# EAGLE design ESC (EAGLE 9.6.2)

## Sheet 1 of 2: Connectors
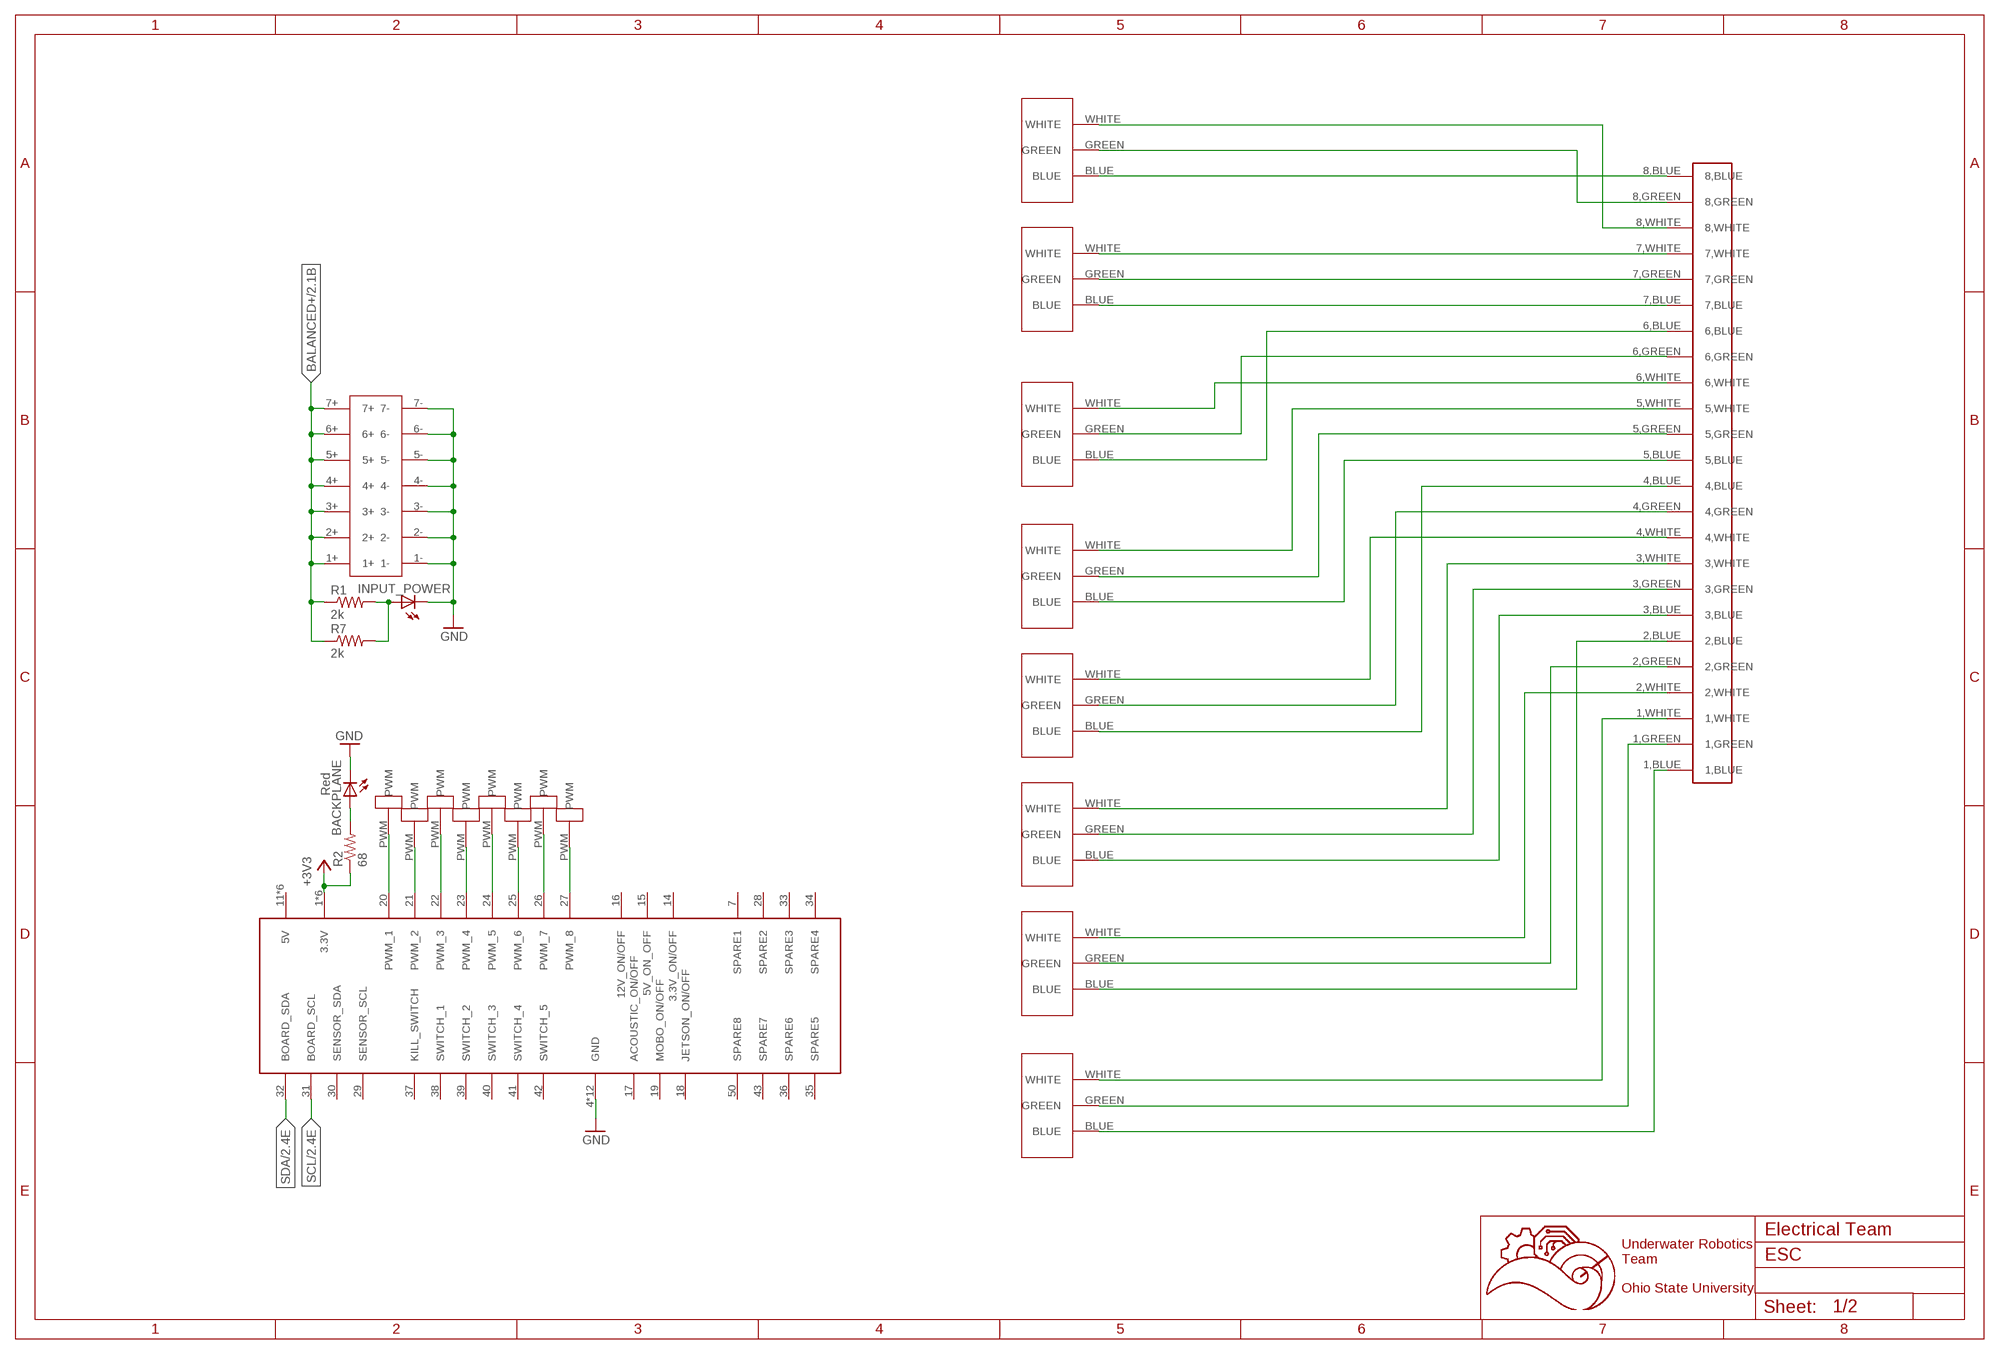
[diagram p0: schematic, sheet 1]

### Parts
1  1711738  [1711738]
2  1711738  [1711738]
3  1711738  [1711738]
4  1711738  [1711738]
5  1711738  [1711738]
6  1711738  [1711738]
7  1711738  [1711738]
8  1711738  [1711738]
BACKPLANE  Red  LEDCHIPLED_0603  [CHIPLED_0603]
INPUT_POWER  LEDCHIPLED_0603  [CHIPLED_0603]
P5  MALE1PINHEADER  [MALE1PINHEADER]
P6  MALE1PINHEADER  [MALE1PINHEADER]
P7  MALE1PINHEADER  [MALE1PINHEADER]
P8  MALE1PINHEADER  [MALE1PINHEADER]
R1  2k  R-US_R0603  [R0603]
R2  68  R-US_R0603  [R0603]
R7  2k  R-US_R0603  [R0603]
U$1  5530843-EDGE  [5530843-6-BOARDFINGERS]
U$18  24PINCONVERTER  [24PINCONVERTER]
U$19  14PIN_VERT  [14PIN_VERT]
U$20  MALE1PINHEADER  [MALE1PINHEADER]
U$21  MALE1PINHEADER  [MALE1PINHEADER]
U$22  MALE1PINHEADER  [MALE1PINHEADER]
U$23  MALE1PINHEADER  [MALE1PINHEADER]

### Nets
+3V3: R2.1 U$1.1(3.3V) U$1.2(3.3V) U$1.3(3.3V) U$1.54(3.3V) U$1.55(3.3V) U$1.56(3.3V) ; also sheet 2
BALANCED+: R1.1 R7.1 U$19.1+ U$19.2+ U$19.3+ U$19.4+ U$19.5+ U$19.6+ U$19.7+ ; also sheet 2
GND: BACKPLANE.C INPUT_POWER.C U$1.4(GND) U$1.5(GND) U$1.6(GND) U$1.8(GND) U$1.9(GND) U$1.10(GND) U$1.47(GND) U$1.48(GND) U$1.49(GND) U$1.51(GND) U$1.52(GND) U$1.53(GND) U$19.1- U$19.2- U$19.3- U$19.4- U$19.5- U$19.6- U$19.7- ; also sheet 2
N$1: 1.GREEN U$18.1,GREEN
N$2: 8.WHITE U$18.8,WHITE
N$3: 8.GREEN U$18.8,GREEN
N$4: 8.BLUE U$18.8,BLUE
N$5: 7.GREEN U$18.7,GREEN
N$6: 7.BLUE U$18.7,BLUE
N$7: 6.WHITE U$18.6,WHITE
N$8: 6.GREEN U$18.6,GREEN
N$9: 6.BLUE U$18.6,BLUE
N$10: 5.WHITE U$18.5,WHITE
N$11: 5.GREEN U$18.5,GREEN
N$12: 5.BLUE U$18.5,BLUE
N$13: 4.WHITE U$18.4,WHITE
N$14: 4.GREEN U$18.4,GREEN
N$15: 4.BLUE U$18.4,BLUE
N$16: 3.BLUE U$18.3,BLUE
N$17: 3.WHITE U$18.3,WHITE
N$18: 3.GREEN U$18.3,GREEN
N$19: 2.WHITE U$18.2,WHITE
N$20: 2.GREEN U$18.2,GREEN
N$21: 2.BLUE U$18.2,BLUE
N$22: 1.WHITE U$18.1,WHITE
N$23: 7.WHITE U$18.7,WHITE
N$24: 1.BLUE U$18.1,BLUE
N$25: INPUT_POWER.A R1.2 R7.2
N$26: BACKPLANE.A R2.2
PWM_1: U$1.20(PWM_1) U$20.PWM
PWM_2: U$1.21(PWM_2) U$21.PWM
PWM_3: U$1.22(PWM_3) U$22.PWM
PWM_4: U$1.23(PWM_4) U$23.PWM
PWM_5: P5.PWM U$1.24(PWM_5)
PWM_6: P6.PWM U$1.25(PWM_6)
PWM_7: P7.PWM U$1.26(PWM_7)
PWM_8: P8.PWM U$1.27(PWM_8)
SCL: U$1.31(BOARD_SCL) ; also sheet 2
SDA: U$1.32(BOARD_SDA) ; also sheet 2
Unconnected: U$1.7(SPARE1) U$1.11(5V) U$1.12(5V) U$1.13(5V) U$1.14(3.3V_ON/OFF) U$1.15(5V_ON_OFF) U$1.16(12V_ON/OFF) U$1.17(ACOUSTIC_ON/OFF) U$1.18(JETSON_ON/OFF) U$1.19(MOBO_ON/OFF) U$1.28(SPARE2) U$1.29(SENSOR_SCL) U$1.30(SENSOR_SDA) U$1.33(SPARE3) U$1.34(SPARE4) U$1.35(SPARE5) U$1.36(SPARE6) U$1.37(KILL_SWITCH) U$1.38(SWITCH_1) U$1.39(SWITCH_2) U$1.40(SWITCH_3) U$1.41(SWITCH_4) U$1.42(SWITCH_5) U$1.43(SPARE7) U$1.44(5V) U$1.45(5V) U$1.46(5V) U$1.50(SPARE8)

### Notes on the sheet
- Electrical Team
- Underwater Robotics
  Team
  
  Ohio State University

## Sheet 2 of 2
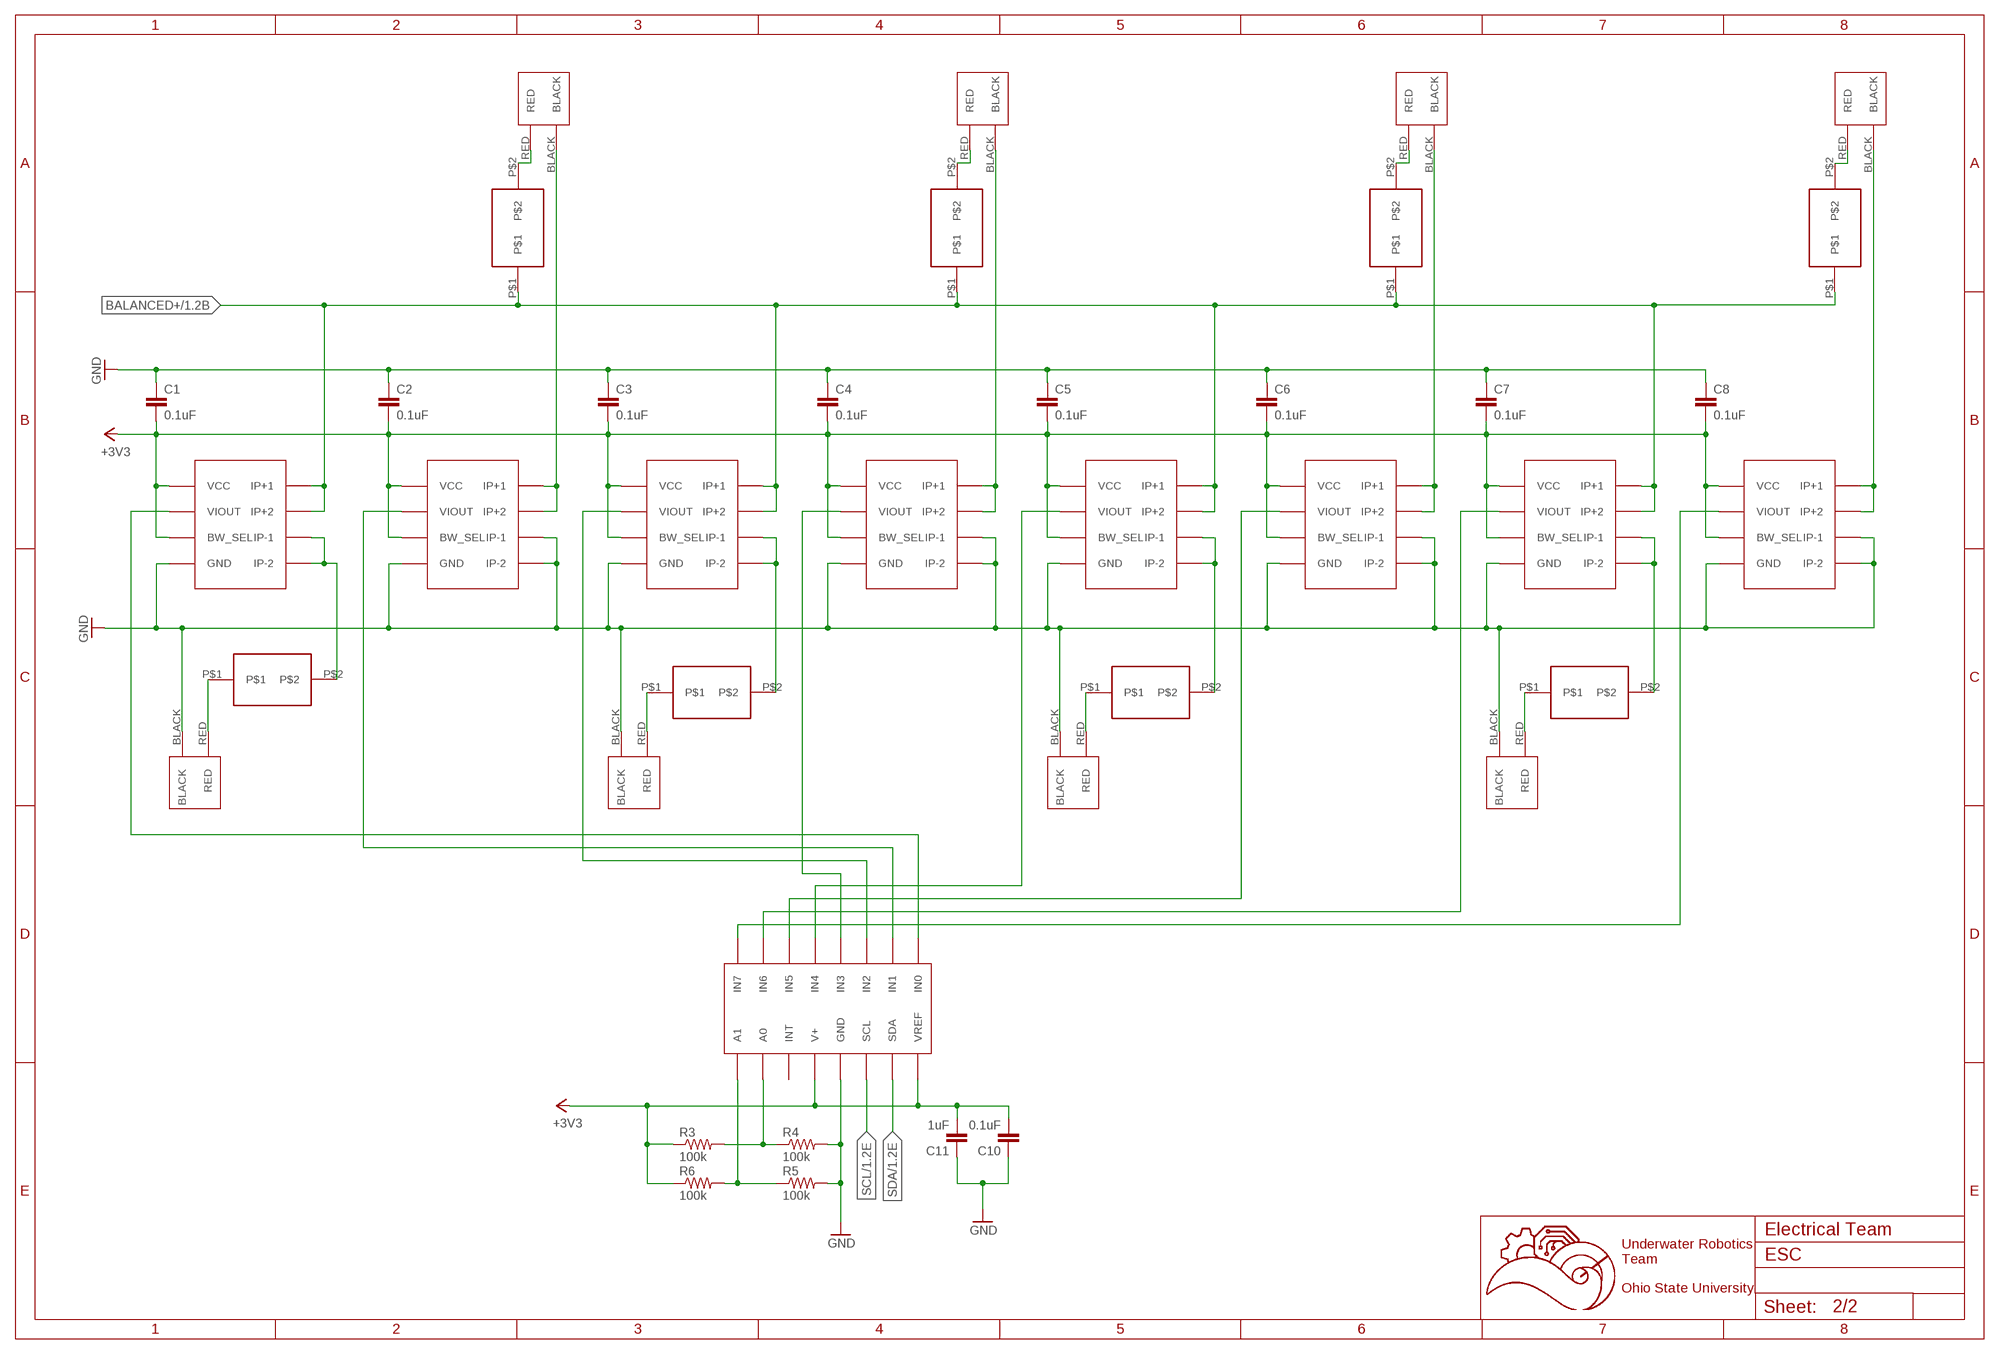
[diagram p1: schematic, sheet 2]

### Parts
1C  ACS722  [SOIC-8]
1CONNECT  1711725  [1711725]
2C  ACS722  [SOIC-8]
2CONNECT  1711725  [1711725]
3C  ACS722  [SOIC-8]
3CONNECT  1711725  [1711725]
4C  ACS722  [SOIC-8]
4CONNECT  1711725  [1711725]
5C  ACS722  [SOIC-8]
5CONNECT  1711725  [1711725]
6C  ACS722  [SOIC-8]
7C  ACS722  [SOIC-8]
7CONNECT  1711725  [1711725]
8C  ACS722  [SOIC-8]
8CONNECT  1711725  [1711725]
C1  0.1uF  C-EUC0603  [C0603]
C2  0.1uF  C-EUC0603  [C0603]
C3  0.1uF  C-EUC0603  [C0603]
C4  0.1uF  C-EUC0603  [C0603]
C5  0.1uF  C-EUC0603  [C0603]
C6  0.1uF  C-EUC0603  [C0603]
C7  0.1uF  C-EUC0603  [C0603]
C8  0.1uF  C-EUC0603  [C0603]
C10  0.1uF  C-EUC0603  [C0603]
C11  1uF  C-EUC0603  [C0603]
CONNECT  1711725  [1711725]
R3  100k  R-US_R0603  [R0603]
R4  100k  R-US_R0603  [R0603]
R5  100k  R-US_R0603  [R0603]
R6  100k  R-US_R0603  [R0603]
U$2  1206SFH  [1206SFH]
U$3  1206SFH  [1206SFH]
U$4  1206SFH  [1206SFH]
U$5  1206SFH  [1206SFH]
U$6  1206SFH  [1206SFH]
U$7  1206SFH  [1206SFH]
U$8  1206SFH  [1206SFH]
U$9  1206SFH  [1206SFH]
U$24  ADC128D818  [TSSOP-16]

### Nets
0ADC: 1C.VIOUT U$24.IN0
1ADC: 2C.VIOUT U$24.IN1
2ADC: 3C.VIOUT U$24.IN2
3ADC: 4C.VIOUT U$24.IN3
4ADC: 5C.VIOUT U$24.IN4
5ADC: 6C.VIOUT U$24.IN5
6ADC: 7C.VIOUT U$24.IN6
7ADC: 8C.VIOUT U$24.IN7
+3V3: 1C.BW_SEL 1C.VCC 2C.BW_SEL 2C.VCC 3C.BW_SEL 3C.VCC 4C.BW_SEL 4C.VCC 5C.BW_SEL 5C.VCC 6C.BW_SEL 6C.VCC 7C.BW_SEL 7C.VCC 8C.BW_SEL 8C.VCC C1.2 C2.2 C3.2 C4.2 C5.2 C6.2 C7.2 C8.2 C10.2 C11.2 R3.1 R6.1 U$24.V+ U$24.VREF ; also sheet 1
BALANCED+: 1C.IP+1 1C.IP+2 3C.IP+1 3C.IP+2 5C.IP+1 5C.IP+2 7C.IP+1 7C.IP+2 U$2.P$1 U$3.P$1 U$4.P$1 U$5.P$1 ; also sheet 1
GND: 1C.GND 1CONNECT.BLACK 2C.GND 2C.IP-1 2C.IP-2 3C.GND 3CONNECT.BLACK 4C.GND 4C.IP-1 4C.IP-2 5C.GND 5CONNECT.BLACK 6C.GND 6C.IP-1 6C.IP-2 7C.GND 7CONNECT.BLACK 8C.GND 8C.IP-1 8C.IP-2 C1.1 C2.1 C3.1 C4.1 C5.1 C6.1 C7.1 C8.1 C10.1 C11.1 R4.2 R5.2 U$24.GND ; also sheet 1
N$27: 8C.IP+1 8C.IP+2 8CONNECT.BLACK
N$28: 2CONNECT.RED U$2.P$2
N$29: 4CONNECT.RED U$4.P$2
N$30: 1C.IP-1 1C.IP-2 U$6.P$2
N$31: CONNECT.RED U$5.P$2
N$32: 2C.IP+1 2C.IP+2 2CONNECT.BLACK
N$33: 3C.IP-1 3C.IP-2 U$7.P$2
N$34: 5C.IP-1 5C.IP-2 U$8.P$2
N$35: 4C.IP+1 4C.IP+2 4CONNECT.BLACK
N$36: 6C.IP+1 6C.IP+2 CONNECT.BLACK
N$37: 7C.IP-1 7C.IP-2 U$9.P$2
N$38: 8CONNECT.RED U$3.P$2
N$39: 1CONNECT.RED U$6.P$1
N$40: 3CONNECT.RED U$7.P$1
N$41: 5CONNECT.RED U$8.P$1
N$42: 7CONNECT.RED U$9.P$1
N$44: R3.2 R4.1 U$24.A0
N$46: R5.1 R6.2 U$24.A1
SCL: U$24.SCL ; also sheet 1
SDA: U$24.SDA ; also sheet 1
Unconnected: U$24.INT

### Notes on the sheet
- Electrical Team
- Underwater Robotics
  Team
  
  Ohio State University

## Library data of the parts
1-8 = Screw_Terminals:1711738
1C 2C 3C 4C 5C 6C 7C 8C = ACS722:ACS722
1CONNECT 2CONNECT 3CONNECT 4CONNECT 5CONNECT 7CONNECT 8CONNECT CONNECT = Screw_Terminals:1711725: 2-pin screw terminal
BACKPLANE INPUT_POWER = led:LED: LED OSRAM: - CHIPLED LG R971, LG N971, LY N971, LG Q971, LY Q971, LO R971, LY R971 LH N974, LH R974 LS Q976, LO Q976, LY Q976 LO Q996 - Hyper CHIPLED LW Q18S LB Q993, LB Q99A, LB R99A - SideLED LS A670, LO A670, LY A670, LG A670, LP A670 LB A673, LV A673, LT A673, LW A673 LH A674 LY A675 LS A676, LA A676, LO A676, LY A676, LW A676 LS A679, LY A679, LG A679 - Hyper Micro SIDELED® LS Y876, LA Y876, LO Y876, LY Y876 LT Y87S - SmartLED LW L88C, LW L88S LB L89C, LB L89S, LG L890 LS L89K, LO L89K, LY L89K LS L896, LA L896, LO L896, LY L896 - TOPLED LS T670, LO T670, LY T670, LG T670, LP T670 LSG T670, LSP T670, LSY T670, LOP T670, LYG T670 LG T671, LOG T671, LSG T671 LB T673, LV T673, LT T673, LW T673 LH T674 LS T676, LA T676, LO T676, LY T676, LB T676, LH T676, LSB T676, LW T676 LB T67C, LV T67C, LT T67C, LS T67K, LO T67K, LY T67K, LW E67C LS E67B, LA E67B, LO E67B, LY E67B, LB E67C, LV E67C, LT E67C LW T67C LS T679, LY T679, LG T679 LS T770, LO T770, LY T770, LG T770, LP T770 LB T773, LV T773, LT T773, LW T773 LH T774 LS E675, LA E675, LY E675, LS T675 LS T776, LA T776, LO T776, LY T776, LB T776 LHGB T686 LT T68C, LB T68C - Hyper Mini TOPLED® LB M676 - Mini TOPLED Santana® LG M470 LS M47K, LO M47K, LY M47K Source: http://www.osram.convergy.de LUXEON: - LUMILED® LXK2-PW12-R00, LXK2-PW12-S00, LXK2-PW14-U00, LXK2-PW14-V00 LXK2-PM12-R00, LXK2-PM12-S00, LXK2-PM14-U00 LXK2-PE12-Q00, LXK2-PE12-R00, LXK2-PE12-S00, LXK2-PE14-T00, LXK2-PE14-U00 LXK2-PB12-K00, LXK2-PB12-L00, LXK2-PB12-M00, LXK2-PB14-N00, LXK2-PB14-P00, LXK2-PB14-Q00 LXK2-PR12-L00, LXK2-PR12-M00, LXK2-PR14-Q00, LXK2-PR14-R00 LXK2-PD12-Q00, LXK2-PD12-R00, LXK2-PD12-S00 LXK2-PH12-R00, LXK2-PH12-S00 LXK2-PL12-P00, LXK2-PL12-Q00, LXK2-PL12-R00 Source: www.luxeon.com KINGBRIGHT: KA-3528ASYC Source: www.kingbright.com
C1-C8 C10 C11 = rcl:C-EU: CAPACITOR, European symbol; SPICEPREFIX: C
P5-P8 U$20-U$23 = Male_Header_1Pin:MALE1PINHEADER
R1-R7 = resistor:R-US_: RESISTOR, American symbol
U$1 = 5530843-6:5530843-EDGE
U$2-U$9 = 1206SFH:1206SFH
U$18 = 24_Pin_Connector:24PINCONVERTER
U$19 = 14_Pin_Connector_Vert:14PIN_VERT
U$24 = ADC128D818:ADC128D818

## Board
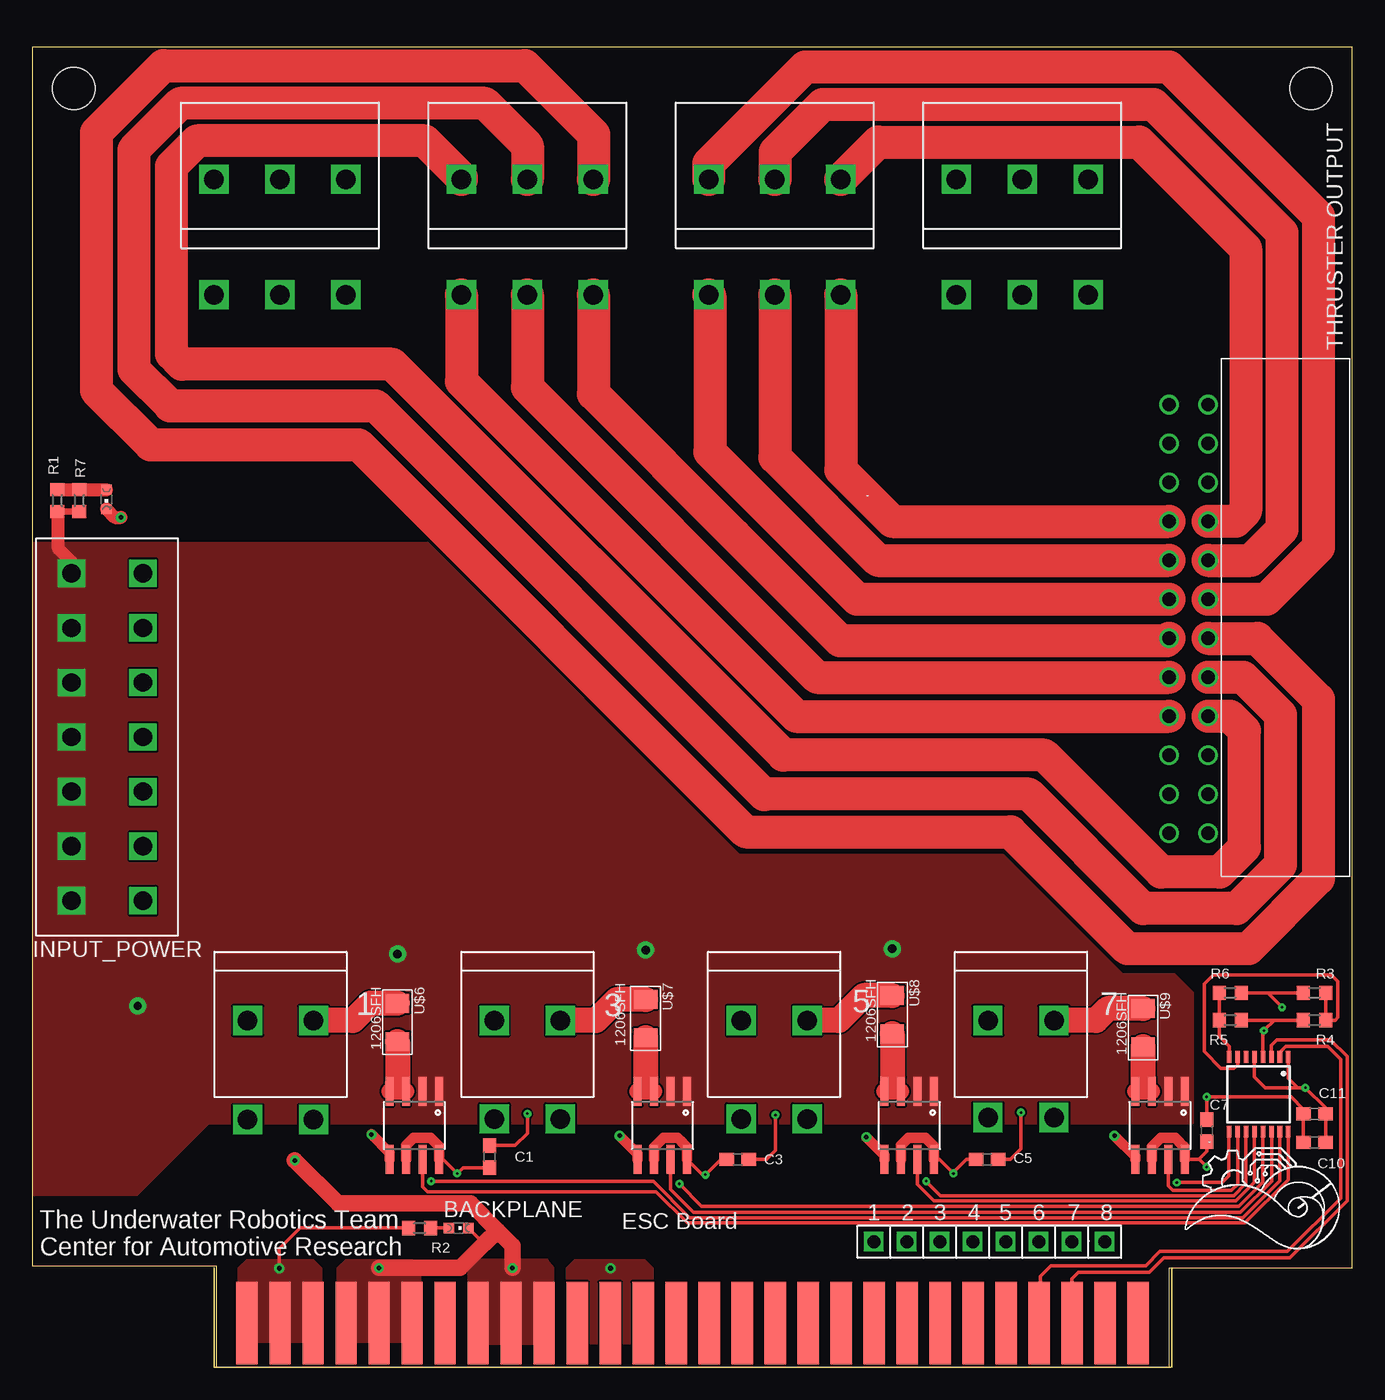
[diagram p2: board, top side]
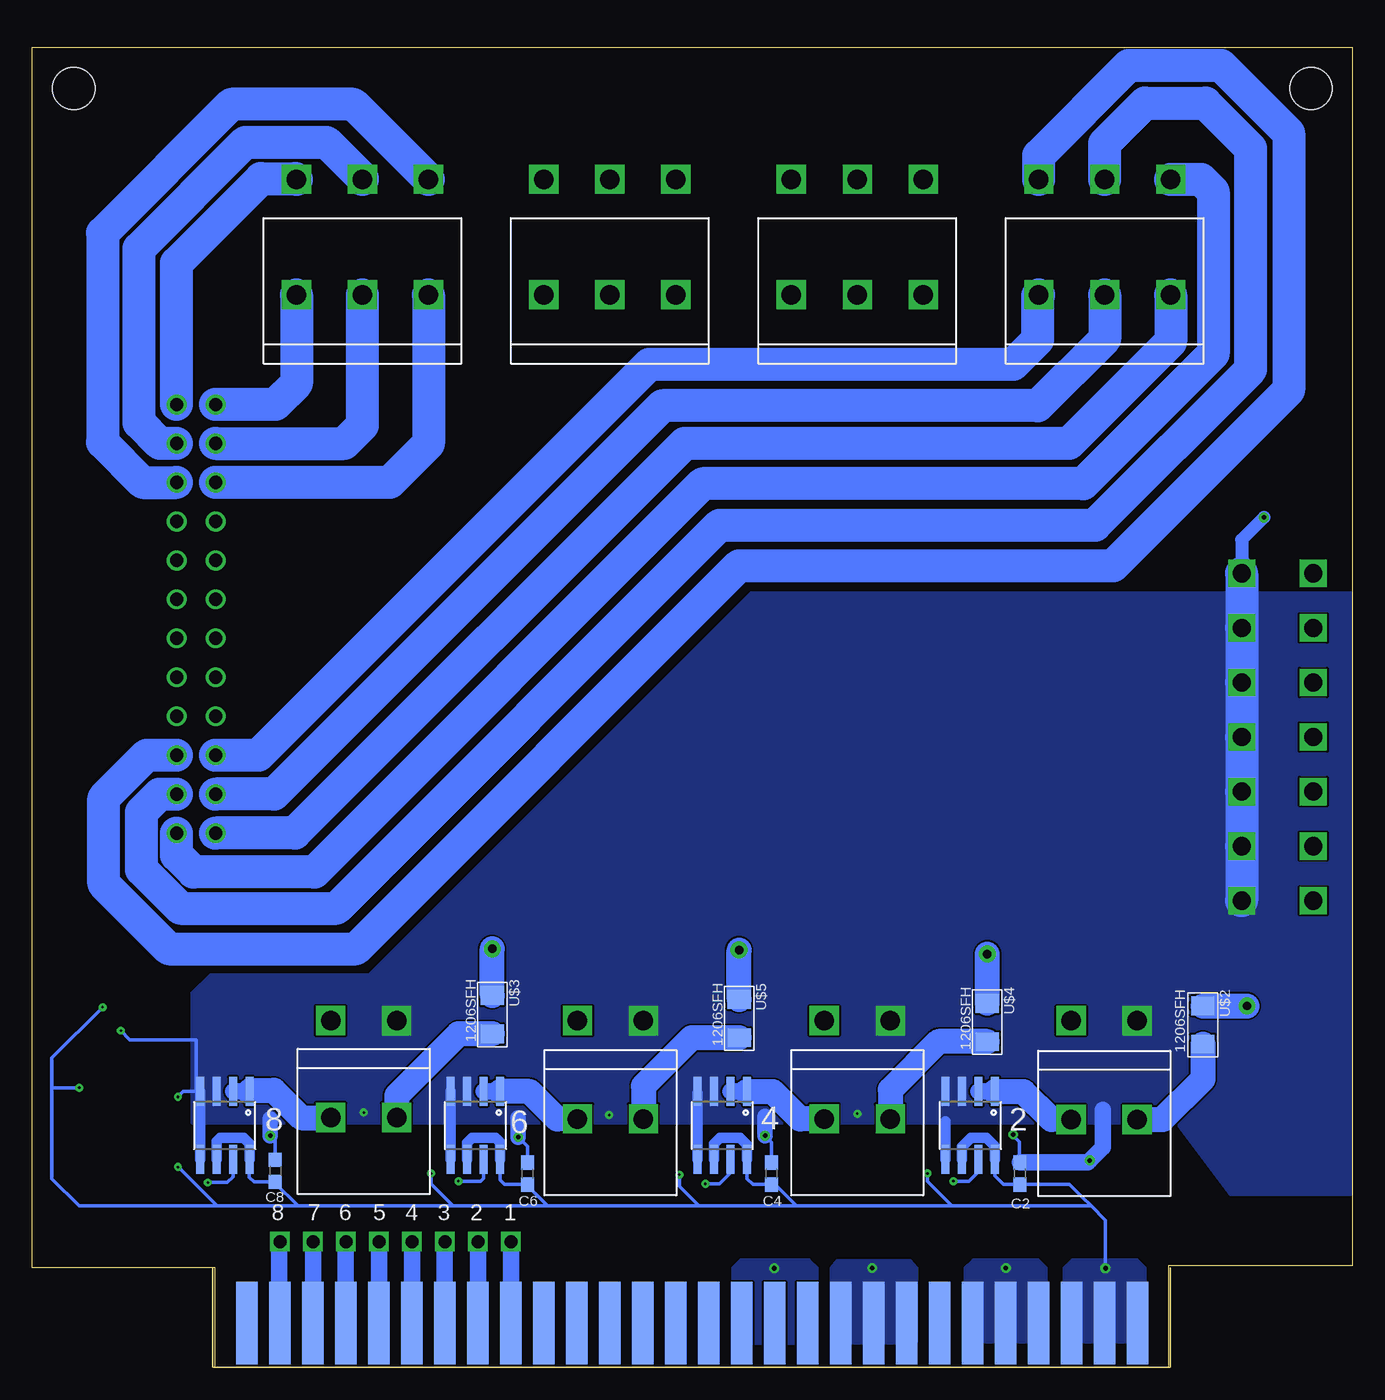
[diagram p3: board, bottom side, seen from below]

Size 101.6 x 101.6 mm. Coordinates in mm from the lower left corner, seen from the top.
Outline: 14.14,7.8 14.14,0 87.53,0 87.53,7.62 101.6,7.62 101.6,101.6 0,101.6 0,7.8 14.14,7.8
Copper layers (1*16): Top 0.035mm / dielectric 1.5mm / Bottom 0.035mm
Design rules "default *": minimum track width 6mil, minimum drill 0.2mm, track to track 6mil, track to pad 6mil, pad to pad 6mil, via to via 6mil, smd to smd 6mil, copper to edge 0.00508125mm, drill to drill 6mil, minimum pad ring 10mil, minimum via ring 8mil, stop-mask expansion 4mil, vias tented up to drill 0mil, thermal gap 10mil
Holes 3.26 mm at 3.17,98.42 98.42,98.42

### Footprints (pad centres in the part's own frame; a part is rotated, then mirrored left to right if it is on the bottom)
1711738 = drill 1.5 square: BLUE -5.08,0; GREEN 0,0; WHITE 5.08,0
SOIC-8 = smd 0.61 x 2.21: BW_SEL 0.635,2.616; GND 1.905,2.616; IP+1 -1.905,-2.616; IP+2 -0.635,-2.616; IP-1 0.635,-2.616; IP-2 1.905,-2.616; VCC -1.905,2.616; VIOUT -0.635,2.616
1711725 = drill 1.5 square: BLACK -2.54,0; RED 2.54,0
CHIPLED_0603 = smd 0.8 x 0.8: A 0,-0.75; C 0,0.75
C0603 = smd 1.1 x 1: 1 -0.85,0; 2 0.85,0
MALE1PINHEADER = drill 1 square: PWM 0,0
R0603 = smd 1 x 1.1: 1 -0.85,0; 2 0.85,0
5530843-6-BOARDFINGERS = smd 1.651 x 6.35 bottom: 1 0.826,3.375; 2 3.365,3.375; 3 5.905,3.375; 4 8.445,3.375; 5 10.986,3.375; 6 13.525,3.375; 7 16.066,3.375; 8 18.605,3.375; 9 21.145,3.375; 10 23.686,3.375; 11 26.226,3.375; 12 28.765,3.375; 13 31.305,3.375; 14 33.846,3.375; 15 36.386,3.375; 16 38.925,3.375; 17 41.465,3.375; 18 44.005,3.375; 19 46.545,3.375; 20 49.086,3.375; 21 51.626,3.375; 22 54.166,3.375; 23 56.706,3.375; 24 59.245,3.375; 25 61.785,3.375; 26 64.326,3.375; 27 66.865,3.375; 28 69.406,3.375 | smd 1.651 x 6.35: 29 69.406,3.375; 30 66.865,3.375; 31 64.326,3.375; 32 61.785,3.375; 33 59.245,3.375; 34 56.706,3.375; 35 54.166,3.375; 36 51.626,3.375; 37 49.086,3.375; 38 46.545,3.375; 39 44.005,3.375; 40 41.465,3.375; 41 38.925,3.375; 42 36.386,3.375; 43 33.846,3.375; 44 31.305,3.375; 45 28.765,3.375; 46 26.226,3.375; 47 23.686,3.375; 48 21.145,3.375; 49 18.605,3.375; 50 16.066,3.375; 51 13.525,3.375; 52 10.986,3.375; 53 8.445,3.375; 54 5.905,3.375; 55 3.365,3.375; 56 0.826,3.375
1206SFH = smd 1.448 x 1.803: P$1 0,0; P$2 2.946,0
24PINCONVERTER = drill 1.02: 1,BLUE 3,0; 1,GREEN 3,3; 1,WHITE 3,6; 2,BLUE 0,6; 2,GREEN 0,3; 2,WHITE 0,0; 3,BLUE 3,9; 3,GREEN 3,12; 3,WHITE 3,15; 4,BLUE 0,15; 4,GREEN 0,12; 4,WHITE 0,9; 5,BLUE 3,18; 5,GREEN 3,21; 5,WHITE 3,24; 6,BLUE 0,24; 6,GREEN 0,21; 6,WHITE 0,18; 7,BLUE 3,27; 7,GREEN 3,30; 7,WHITE 3,33; 8,BLUE 0,33; 8,GREEN 0,30; 8,WHITE 0,27
14PIN_VERT = drill 1.4 square: 1+ 0,0; 1- 5.5,0; 2+ 0,4.2; 2- 5.5,4.2; 3+ 0,8.4; 3- 5.5,8.4; 4+ 0,12.6; 4- 5.5,12.6; 5+ 0,16.8; 5- 5.5,16.8; 6+ 0,21; 6- 5.5,21; 7+ 0,25.2; 7- 5.5,25.2
TSSOP-16 = smd 0.9 x 0.35: A0 -2.875,-1.625; A1 -2.875,-2.275; GND -2.875,0.325; IN0 2.875,2.275; IN1 2.875,1.625; IN2 2.875,0.975; IN3 2.875,0.325; IN4 2.875,-0.325; IN5 2.875,-0.975; IN6 2.875,-1.625; IN7 2.875,-2.275; INT -2.875,-0.975; SCL -2.875,0.975; SDA -2.875,1.625; V+ -2.875,-0.325; VREF -2.875,2.275

### Placement (x,y rotation side)
1  19.05,91.44 0 top
1C  29.4,18.6 180 top
1CONNECT  19.1,26.67 0 top
2  19.05,82.55 0 bottom
2C  29.4,18.6 180 bottom
2CONNECT  19.1,19.05 0 bottom
3  38.1,91.44 0 top
3C  48.5,18.6 180 top
3CONNECT  38.1,26.67 0 top
4  38.1,82.55 0 bottom
4C  48.5,18.6 180 bottom
4CONNECT  38.1,19.1 0 bottom
5  57.15,91.44 0 top
5C  67.5,18.6 180 top
5CONNECT  57.1,26.67 0 top
6  57.15,82.55 0 bottom
6C  67.5,18.6 180 bottom
7  76.2,91.44 0 top
7C  86.8,18.6 180 top
7CONNECT  76.1,26.67 0 top
8  76.2,82.55 0 bottom
8C  86.8,18.6 180 bottom
8CONNECT  76.1,19.2 0 bottom
BACKPLANE  32.8,10.7 270 top
C1  35.2,16.2 270 top
C2  25.6,14.9 270 bottom
C3  54.3,16 180 top
C4  44.7,14.9 270 bottom
C5  73.5,16 180 top
C6  63.5,14.9 270 bottom
C7  90.4,18.2 270 top
C8  82.9,15.1 270 bottom
C10  98.7,17.3 0 top
C11  98.7,19.5 0 top
CONNECT  57.1,19.1 0 bottom
INPUT_POWER  5.7,66.8 180 top
P5  74.93,9.65 0 top
P6  77.47,9.65 0 top
P7  80.01,9.65 0 top
P8  82.55,9.65 90 top
R1  1.9,66.7 90 top
R2  29.8,10.7 0 top
R3  98.7,28.8 0 top
R4  98.7,26.7 180 top
R5  92.2,26.7 0 top
R6  92.2,28.8 180 top
R7  3.6,66.7 90 top
U$1  15.7,0 0 top
U$2  11.5,27.8 270 bottom
U$3  66.2,28.6 270 bottom
U$4  28.1,28 270 bottom
U$5  47.2,28.3 270 bottom
U$6  28.1,28 270 top
U$7  47.2,28.3 270 top
U$8  66.2,28.6 270 top
U$9  85.5,27.6 270 top
U$18  87.5,41.1 0 top
U$19  3,35.9 0 top
U$20  64.77,9.65 270 top
U$21  67.31,9.65 0 top
U$22  69.85,9.65 0 top
U$23  72.39,9.65 0 top
U$24  94.4,21 270 top

### Tracks (layer width: path | path; a pad name or v marks a point on that pad's centre or on a via)
0ADC
  Top 0.254: 1C.VIOUT 30.04,13.87 30.4,13.5 48,13.5 50.41,11.09 93.34,11.09 96.68,14.43 U$24.IN0
1ADC  (via drill 0.2 pad 0.55)
  Top 0.254: v30.7,14.3 47.8,14.3 50.6,11.5 50.61,11.49 93.17,11.49 96.03,14.35 U$24.IN1
  Bottom 0.254: 2C.VIOUT 28.77,15.04 29.5,14.3 v30.7,14.3
2ADC
  Top 0.254: 3C.VIOUT 49.13,13.66 50.9,11.9 93,11.9 95.4,14.3 95.4,18.1 U$24.IN2
3ADC  (via drill 0.2 pad 0.55)
  Top 0.254: v49.8,14.1 51.52,12.38 92.88,12.38 94.72,14.22 U$24.IN3
  Bottom 0.254: 4C.VIOUT 47.87,14.94 48.7,14.1 v49.8,14.1
4ADC
  Top 0.254: U$24.IN4 94.08,14.23 92.64,12.79 69.4,12.79 68.14,14.05 5C.VIOUT
5ADC  (via drill 0.2 pad 0.55)
  Top 0.254: v68.8,14.3 69.91,13.19 92.47,13.19 93.42,14.15 U$24.IN5
  Bottom 0.254: 6C.VIOUT 66.86,14.54 67.1,14.3 v68.8,14.3
6ADC
  Top 0.254: 7C.VIOUT 87.44,13.96 87.8,13.6 92.3,13.6 92.78,14.07 U$24.IN6
7ADC  (via drill 0.2 pad 0.55)
  Top 0.254: v88.1,14.2 91.6,14.2 92.1,14.7 92.1,18.1 U$24.IN7
  Bottom 0.254: 8C.VIOUT 86.17,14.63 86.6,14.2 v88.1,14.2
+3V3  (via drill 0.2, 0.2 pad 0.55, 0.35)
  Top 0.254: R2.1 20.6,10.7 19,9.1 v19,7.6 | C3.2 53,16 v51.8,14.8 51.59,14.8 3C.VCC | C5.2 71.9,16 70.9,15 v70.9,14.9 69.82,15.98 5C.VCC | 89.78,15.98 90.4,16.6 C7.2 | v90.4,15.4 89.82,15.98 89.78,15.98 | U$24.V+ 94.08,22.32 94.9,21.5 v98,21.5 | v98,21.5 97.4,21.5 96.67,22.23 U$24.VREF | C10.2 C11.2 99.55,19.95 v98,21.5 | 89.78,15.98 7C.VCC | 1C.VCC 31.62,15.98 v32.7,14.9 33.15,15.35 C1.2 | R6.1 95.1,28.8 | 95.1,28.8 R3.1 | v96.2,27.7 95.1,28.8
  Top 0.813: 1C.BW_SEL 28.77,17.07 29.35,17.65 30.65,17.65 31.3,17 1C.VCC | 3C.BW_SEL 47.87,16.91 48.6,17.65 49.67,17.65 50,17.32 50,17.3 50.41,16.89 3C.VCC | 5C.BW_SEL 66.86,17.07 67.45,17.65 68.75,17.65 69.41,17 5C.VCC | 7C.BW_SEL 86.17,16.96 86.85,17.65 87.97,17.65 88.3,17.32 88.3,17.3 88.7,16.89 7C.VCC
  Bottom 0.254: v19,7.6 19,11.3 20.1,12.4 | 20.1,12.4 30.8,12.4 | 30.8,12.4 42.8,12.4 | 42.8,12.4 50.3,12.4 | 50.3,12.4 61.95,12.4 | 61.95,12.4 69.2,12.4 | 69.2,12.4 81.2,12.4 | 81.2,12.4 87.4,12.4 | 87.4,12.4 98,12.4 100.1,14.5 100.1,21.5 | 20.1,12.4 20.8,13.1 21.77,14.05 C2.2 26.85,14.05 27.5,14.7 2C.VCC | 42.8,12.4 44.45,14.05 C4.2 46.15,14.05 46.59,14.49 4C.VCC | v32.7,14.9 32.7,14.3 30.8,12.4 | v51.8,14.8 51.8,13.9 50.3,12.4 | 61.95,12.4 63.5,13.95 C6.2 65.25,14.05 65.6,14.4 6C.VCC | v70.9,14.9 70.9,14.1 69.2,12.4 | 81.2,12.4 81.2,12.45 82.9,14.15 C8.2 84.55,14.25 84.9,14.6 8C.VCC | v90.4,15.4 87.4,12.4 | v98,21.5 100.1,21.5 | 100.1,21.5 100.1,23.8 v96.2,27.7
  Bottom 0.813: 2C.BW_SEL 30.04,16.96 29.35,17.65 28.15,17.65 27.5,17 2C.VCC | 4C.VCC 46.59,17.09 47.15,17.65 48.65,17.65 49.13,17.16 4C.BW_SEL | 6C.VCC 65.59,17.3 65.95,17.65 67.75,17.65 68.14,17.27 6C.BW_SEL | 8C.VCC 84.89,17.2 85.35,17.65 87.15,17.65 87.44,17.36 8C.BW_SEL
  pour Bottom (no thermals): 15.88,7.62 16.51,8.26 21.59,8.26 22.23,7.62 22.23,1.91 15.88,1.91
  pour Top (no thermals): 15.88,7.62 16.51,8.26 21.59,8.26 22.23,7.62 22.23,1.91 15.88,1.91
+5V  (via drill 0.35)
  other vias: 44.5,7.6
  pour Top (no thermals): 41.15,1.78 41.15,7.62 41.78,8.26 47.12,8.26 47.75,7.62 47.75,1.78
  pour Bottom (no thermals): 41.15,1.78 41.15,7.62 41.78,8.26 47.12,8.26 47.75,7.62 47.75,1.78
BALANCED+  (via drill 0.65 pad 1.3)
  Top 0.508: R1.1 R7.1
  Top 1.016: U$19.7+ 3,62 2,63 2,65.75 R1.1
  Bottom 1.905: U$2.P$1 v8.1,27.8 | U$4.P$1 v28.1,31.8 | U$5.P$1 v47.2,32.1 | U$3.P$1 v66.2,32.2
  pour Top (no thermals): 0.11,63.4 0.11,13.3 8.01,13.3 13.51,18.8 89.3,18.8 89.3,28.8 87.9,30.2 83.9,30.2 74.7,39.4 54.4,39.4 30.4,63.4
GND  (via drill 0.2, 0.2 pad 0.55, 0.35, 0.35 pad 0.55)
  Top 0.254: C3.1 56.5,16 57.2,16.7 v57.2,19.4 | C5.1 75.3,16 76.1,16.8 v76.1,19.6 | C7.1 v90.4,20.8 96.9,20.8 97.85,19.85 C11.1 C10.1 | R5.2 95.6,26.7 | 95.6,26.7 R4.2 | 95.6,26.7 v94.8,25.9 94.72,25.82 U$24.GND | BACKPLANE.C 34.77,9.47 | C1.1 37.15,17.05 38.1,18 v38.1,19.5
  Top 0.813: 1C.GND 27.5,16.5 v26.1,17.9 | 3C.GND 46.59,16.41 v45.2,17.8 | 5C.GND 65.59,16.3 v64.2,17.7 | 7C.GND 84.89,16.2 v83.3,17.8
  Top 1.016: INPUT_POWER.C 6.35,65.4 v6.8,65.4
  Top 1.27: v20.2,15.9 23.51,12.59 33.71,12.59 35.8,10.5 | v36.96,7.62 36.96,9.34 35.8,10.5 | v26.67,7.62 32.92,7.62 34.77,9.47 35.8,10.5
  Bottom 0.152: 20.35,15.75 v20.2,15.9 | 31.3,18.91 31.4,19
  Bottom 0.254: C4.1 44.7,17.3 v45.2,17.8 | C6.1 63.5,17 v64.2,17.7 | C8.1 82.9,17.4 v83.3,17.8 | v90.4,20.8 89.98,21.22 88.9,21.22 | 88.9,21.22 8C.IP-2 | 88.9,21.22 89,21.32 89,25.2 94.1,25.2 v94.8,25.9 | v26.1,17.9 26.1,17.8 25.62,17.32 25.62,15.78 C2.1
  Bottom 0.813: 4C.GND 50.41,21.09 50.4,21.1 | 6C.GND 6C.IP-2 | 8C.GND 8C.IP-2 | 2C.GND 31.3,18.91
  Bottom 1.016: v6.8,65.4 8.5,63.7 U$19.7-
  Bottom 1.2: v45.2,17.8 45.2,19.3 | v64.2,17.7 64.2,19.2 | v83.3,17.8 83.3,19.1
  Bottom 1.27: C2.1 20.35,15.75 | v20.2,15.9 19.2,16.9 19.2,19.8
  Bottom 2.54: U$19.7- U$19.6- U$19.5- U$19.4- U$19.3- U$19.2- U$19.1-
  pour Top (no thermals): 23.5,7.62 24.13,8.26 29.21,8.26 29.84,7.62 29.84,1.91 23.5,1.91
  pour Bottom (no thermals): 23.5,7.62 24.13,8.26 29.21,8.26 29.84,7.62 29.84,1.91 23.5,1.91
  pour Top (no thermals): 33.66,1.78 40.13,1.78 40.13,7.62 39.62,8.26 34.04,8.26 33.53,7.62 33.53,1.91
  pour Bottom (no thermals): 33.53,7.62 33.53,1.91 33.66,1.78 40.01,1.78 40.01,4.06 40.01,5.71 40.13,5.84 40.13,7.62 39.62,8.26 34.04,8.26
  pour Bottom (no thermals): 0.11,59.6 46.3,59.6 75.7,30.2 87.9,30.2 89.3,28.8 89.3,18.8 13.51,18.8 9.4,13.3 0.11,13.3
N$1
  Bottom 2.54: 1.GREEN 19.05,94.2 15.95,97.3 11.3,97.3 7.81,93.81 7.81,76.79 19.8,64.8 48.7,64.8 78.19,35.31 90.21,35.31 93.19,38.29 93.19,42.72 91.81,44.1 U$18.1,GREEN
N$2
  Bottom 2.54: 8.WHITE 71.12,71.08 74.1,68.1 U$18.8,WHITE
N$3
  Bottom 2.54: U$18.8,GREEN 77.6,71.1 76.2,72.5 8.GREEN
N$4
  Bottom 2.54: 8.BLUE 81.28,75.72 82.9,74.1 U$18.8,BLUE
N$5
  Bottom 2.54: U$18.7,GREEN 91.8,71.1 93.4,72.7 93.4,86.11 85.22,94.29 78.97,94.29 76.2,91.52 7.GREEN
N$6
  Bottom 2.54: 7.BLUE 76.88,97.2 86.3,97.2 96.2,87.3 96.2,71.2 93.1,68.1 U$18.7,BLUE
N$7
  Top 2.54: U$18.6,WHITE 63.5,59.1 52.15,70.45 52.15,82.47 6.WHITE
N$8
  Top 2.54: 6.GREEN 57.15,70.05 65.1,62.1 U$18.6,GREEN
N$9
  Top 2.54: 6.BLUE 62.23,69.07 66.2,65.1 U$18.6,BLUE
N$10
  Top 2.54: 5.WHITE 65.09,94.3 85.2,94.3 93.4,86.1 93.4,65.9 92.6,65.1 U$18.5,WHITE
N$11
  Top 2.54: U$18.5,GREEN 93.8,62.1 96.2,64.5 96.2,87.31 86.31,97.19 60.82,97.19 57.17,93.54 57.17,91.46 5.GREEN
N$12
  Top 2.54: 5.BLUE 52.07,92.67 59.5,100.1 87.5,100.1 99,88.6 99,63.1 95,59.1 U$18.5,BLUE
N$13
  Top 2.54: 4.WHITE 33.02,75.88 58.8,50.1 U$18.4,WHITE
N$14
  Top 2.54: U$18.4,GREEN 60.4,53.1 38.1,75.4 4.GREEN
N$15
  Top 2.54: 4.BLUE 43.18,74.92 54.05,64.05 62.2,55.9 87.3,55.9 U$18.4,BLUE
N$16
  Top 2.54: 3.BLUE 33.02,91.58 30.2,94.4 12.67,94.4 10.7,92.43 10.7,78 11.5,77.2 27.7,77.2 57.8,47.1 77.9,47.1 86.9,38.1 91.4,38.1 93.3,40 93.3,49 92.2,50.1 U$18.3,BLUE
N$17
  Top 2.54: U$18.3,WHITE 94.3,56.1 99,51.4 99,37.6 93.61,32.21 84.29,32.21 75.3,41.2 54.91,41.2 25.1,71.01 9.09,71.01 4.92,75.19 4.92,95.03 10.07,100.19 37.91,100.19 43.2,94.9 43.2,91.46 3.WHITE
N$18
  Top 2.54: 3.GREEN 38.1,94.02 34.83,97.29 11.38,97.29 7.81,93.72 7.81,76.79 10.6,74 26.4,74 56.35,44.05 56.4,44.1 76.7,44.1 85.5,35.3 92.71,35.3 96.09,38.69 96.09,50.22 93.22,53.09 U$18.3,GREEN
N$19
  Bottom 2.54: 2.WHITE 13.97,78.93 21.8,71.1 51.4,71.1 81.4,41.1 U$18.2,WHITE
N$20
  Bottom 2.54: 2.GREEN 19.05,79.15 24.2,74 53.1,74 83,44.1 U$18.2,GREEN
N$21
  Bottom 2.54: 2.BLUE 24.23,82.45 24.23,79.07 26.1,77.2 54.11,77.2 84.19,47.11 87.49,47.11 U$18.2,BLUE
N$22
  Bottom 2.54: 1.WHITE 24.13,93.27 17.2,100.2 10.1,100.2 4.9,95 4.9,75.19 18.39,61.7 47.2,61.7 76.7,32.2 91.1,32.2 96.1,37.2 96.1,43.8 92.8,47.1 U$18.1,WHITE
N$23
  Bottom 2.54: U$18.7,WHITE 90.5,85 84,91.5 81.34,91.5 7.WHITE
N$24
  Bottom 2.54: 1.BLUE 11.64,91.44 10.7,90.5 10.7,78 20.7,68 50,68 79.9,38.1 89.2,38.1 90.5,39.41 U$18.1,BLUE
N$25
  Top 0.152: R7.2 R1.2
  Top 1.016: R1.2 INPUT_POWER.A
N$26
  Top 0.254: BACKPLANE.A R2.2
N$27
  Bottom 1.27: 8C.IP+1 8C.IP+2
  Bottom 1.905: 8C.IP+1 84.8,21.32 83.02,21.32 80.9,19.2 8CONNECT.BLACK
N$28
  Bottom 1.905: 2CONNECT.RED 14.6,19.05 11.5,22.15 U$2.P$2
N$29
  Bottom 1.905: U$4.P$2 31.85,25.05 35.56,21.34 4CONNECT.RED
N$30
  Top 0.152: 28.1,21.82 1C.IP-2
  Top 1.27: 1C.IP-2 1C.IP-1
  Top 1.905: U$6.P$2 28.1,21.82
N$31
  Bottom 1.905: U$5.P$2 50.85,25.35 54.56,21.64 CONNECT.RED
N$32
  Bottom 1.27: 2C.IP+1 2C.IP+2
  Bottom 1.905: 2CONNECT.BLACK 23.15,19.05 25.3,21.2 27.48,21.2 2C.IP+1
N$33
  Top 0.152: 47.2,21.82 3C.IP-2
  Top 1.27: 3C.IP-2 3C.IP-1
  Top 1.905: U$7.P$2 47.2,21.82
N$34
  Top 0.152: 66.2,21.82 5C.IP-2
  Top 1.27: 5C.IP-2 5C.IP-1
  Top 1.905: U$8.P$2 66.2,21.82
N$35
  Bottom 1.27: 4C.IP+1 4C.IP+2
  Bottom 1.905: 4CONNECT.BLACK 42.5,19.1 44.6,21.2 46.58,21.2 4C.IP+1
N$36
  Bottom 1.27: 6C.IP+1 6C.IP+2
  Bottom 1.905: CONNECT.BLACK 61.2,19.1 63.32,21.22 6C.IP+1
N$37
  Top 0.152: 85.5,21.82 7C.IP-2
  Top 1.27: 7C.IP-2 7C.IP-1
  Top 1.905: U$9.P$2 85.5,21.82
N$38
  Bottom 1.905: U$3.P$2 68.8,25.65 73.56,20.89 8CONNECT.RED
N$39
  Top 1.905: U$6.P$1 26,28 24.67,26.67 1CONNECT.RED
N$40
  Top 1.905: U$7.P$1 45,28.3 43.37,26.67 3CONNECT.RED
N$41
  Top 1.905: U$8.P$1 64,28.6 62.07,26.67 5CONNECT.RED
N$42
  Top 1.905: U$9.P$1 82.8,27.6 81.87,26.67 7CONNECT.RED
N$44
  Top 0.254: R3.2 R4.1 100.3,26.7 100.5,26.9 100.5,29.7 100,30.2 90.9,30.2 90.2,29.5 90.2,24.3 91.5,23 92.5,23 92.78,23.27 U$24.A0
N$46
  Top 0.254: R6.2 R5.1 91.35,25.45 92.12,24.68 U$24.A1
PWM_1
  Bottom 1.016: U$1.20 64.78,2.41 64.8,2.4
  Bottom 1.27: 64.8,2.4 64.8,3.36 64.77,3.39 U$20.PWM
PWM_2
  Bottom 1.27: U$1.21 67.4,3.45 67.31,3.54 U$21.PWM
PWM_3
  Bottom 1.27: U$1.22 69.86,9.64 U$22.PWM
PWM_4
  Bottom 1.27: U$23.PWM 72.39,3.39 U$1.23
PWM_5
  Bottom 1.27: P5.PWM 74.93,3.39 U$1.24
PWM_6
  Bottom 1.27: P6.PWM 77.49,9.61 U$1.25
PWM_7
  Bottom 1.27: P7.PWM 80.01,3.39 U$1.26
PWM_8
  Bottom 1.27: U$1.27 82.6,3.41 82.6,9.38 P8.PWM
SCL
  Top 0.254: U$24.SCL 95.38,24.77 95.8,25.2 99.9,25.2 101.2,23.9 101.2,12.8 96.8,8.4 87.1,8.4 86,7.3 80.5,7.3 80,6.8 80,3.4 U$1.31
SDA
  Top 0.254: U$24.SDA 96.02,24.24 96.48,24.7 99.7,24.7 100.7,23.7 100.7,13 96.6,8.9 86.8,8.9 85.7,7.8 78.4,7.8 77.6,7 77.6,3.49 U$1.32

### Text on the board
tPlace: ESC Board | The Underwater Robotics Team / Center for Automotive Research
tNames: THRUSTER OUTPUT | R1 | R6 | R3 | 1 | 3 | 5 | 7 | R5 | R4 | C11 | C7 | C1 | C3 | C5 | C10 | 1 | 2 | 3 | 4 | 5 | 6 | 7 | 8 | R2
bNames: 2 | 4 | 6 | 8 | C8 | C2 | C4 | C6 | 1 | 2 | 3 | 4 | 5 | 6 | 7 | 8